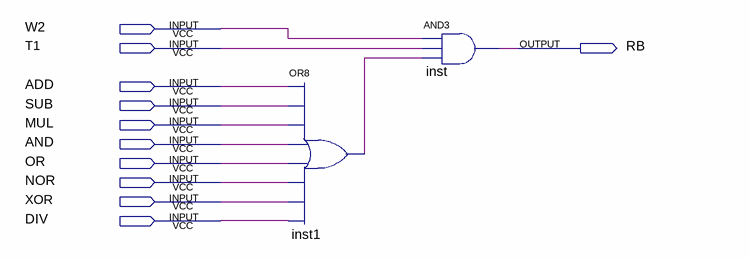
[diagram p0: schematic sheet]
// Quartus schematic RB.bdf as structural Verilog: 2 symbols, 11 pins
module RB (
  input  W2,
  input  T1,
  input  ADD,
  input  SUB,
  input  MUL,
  input  AND,
  input  OR,
  input  NOR,
  input  XOR,
  input  DIV,
  output RB
);

  wire inst1_out;

  or inst1 (inst1_out, ADD, SUB, MUL, AND, OR, NOR, XOR, DIV);
  and inst (RB, W2, T1, inst1_out);
endmodule
